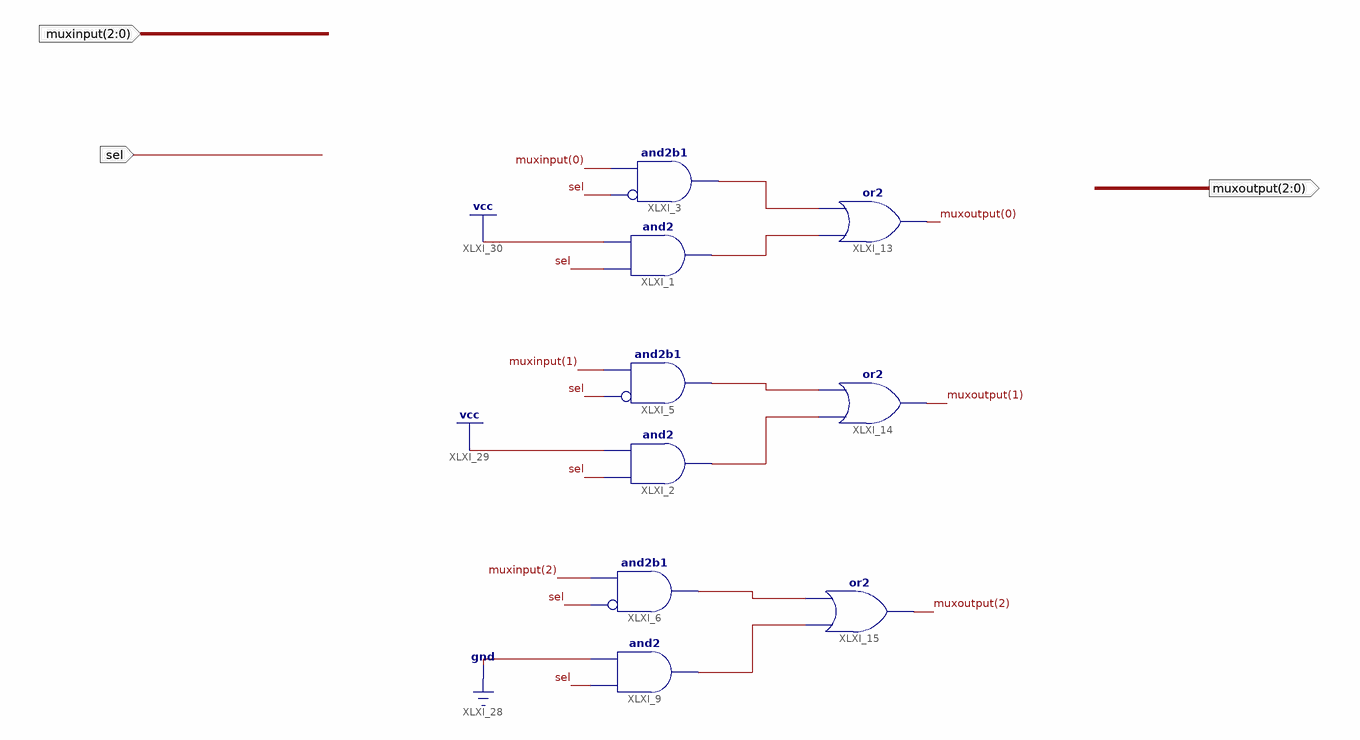
[diagram p0: schematic sheet 1]
// Xilinx ISE schematic ALUFMUX3.sch (spartan2) as structural Verilog: 9 symbols, 3 ports
module ALUFMUX3 (
  input  [2:0] muxinput,
  input  sel,
  output [2:0] muxoutput
);

  wire XLXN_59, XLXN_60, XLXN_61, XLXN_62, XLXN_63, XLXN_64;

  or XLXI_13 (muxoutput[0], XLXN_62, XLXN_61);
  and XLXI_1 (XLXN_62, sel, 1'b1);
  and XLXI_3 (XLXN_61, ~sel, muxinput[0]);  // and2b1
  or XLXI_14 (muxoutput[1], XLXN_60, XLXN_59);
  and XLXI_5 (XLXN_59, ~sel, muxinput[1]);  // and2b1
  and XLXI_2 (XLXN_60, sel, 1'b1);
  or XLXI_15 (muxoutput[2], XLXN_64, XLXN_63);
  and XLXI_6 (XLXN_63, ~sel, muxinput[2]);  // and2b1
  and XLXI_9 (XLXN_64, sel, 1'b0);
endmodule
